# EAGLE design Moteino_Leo (EAGLE 6.3)
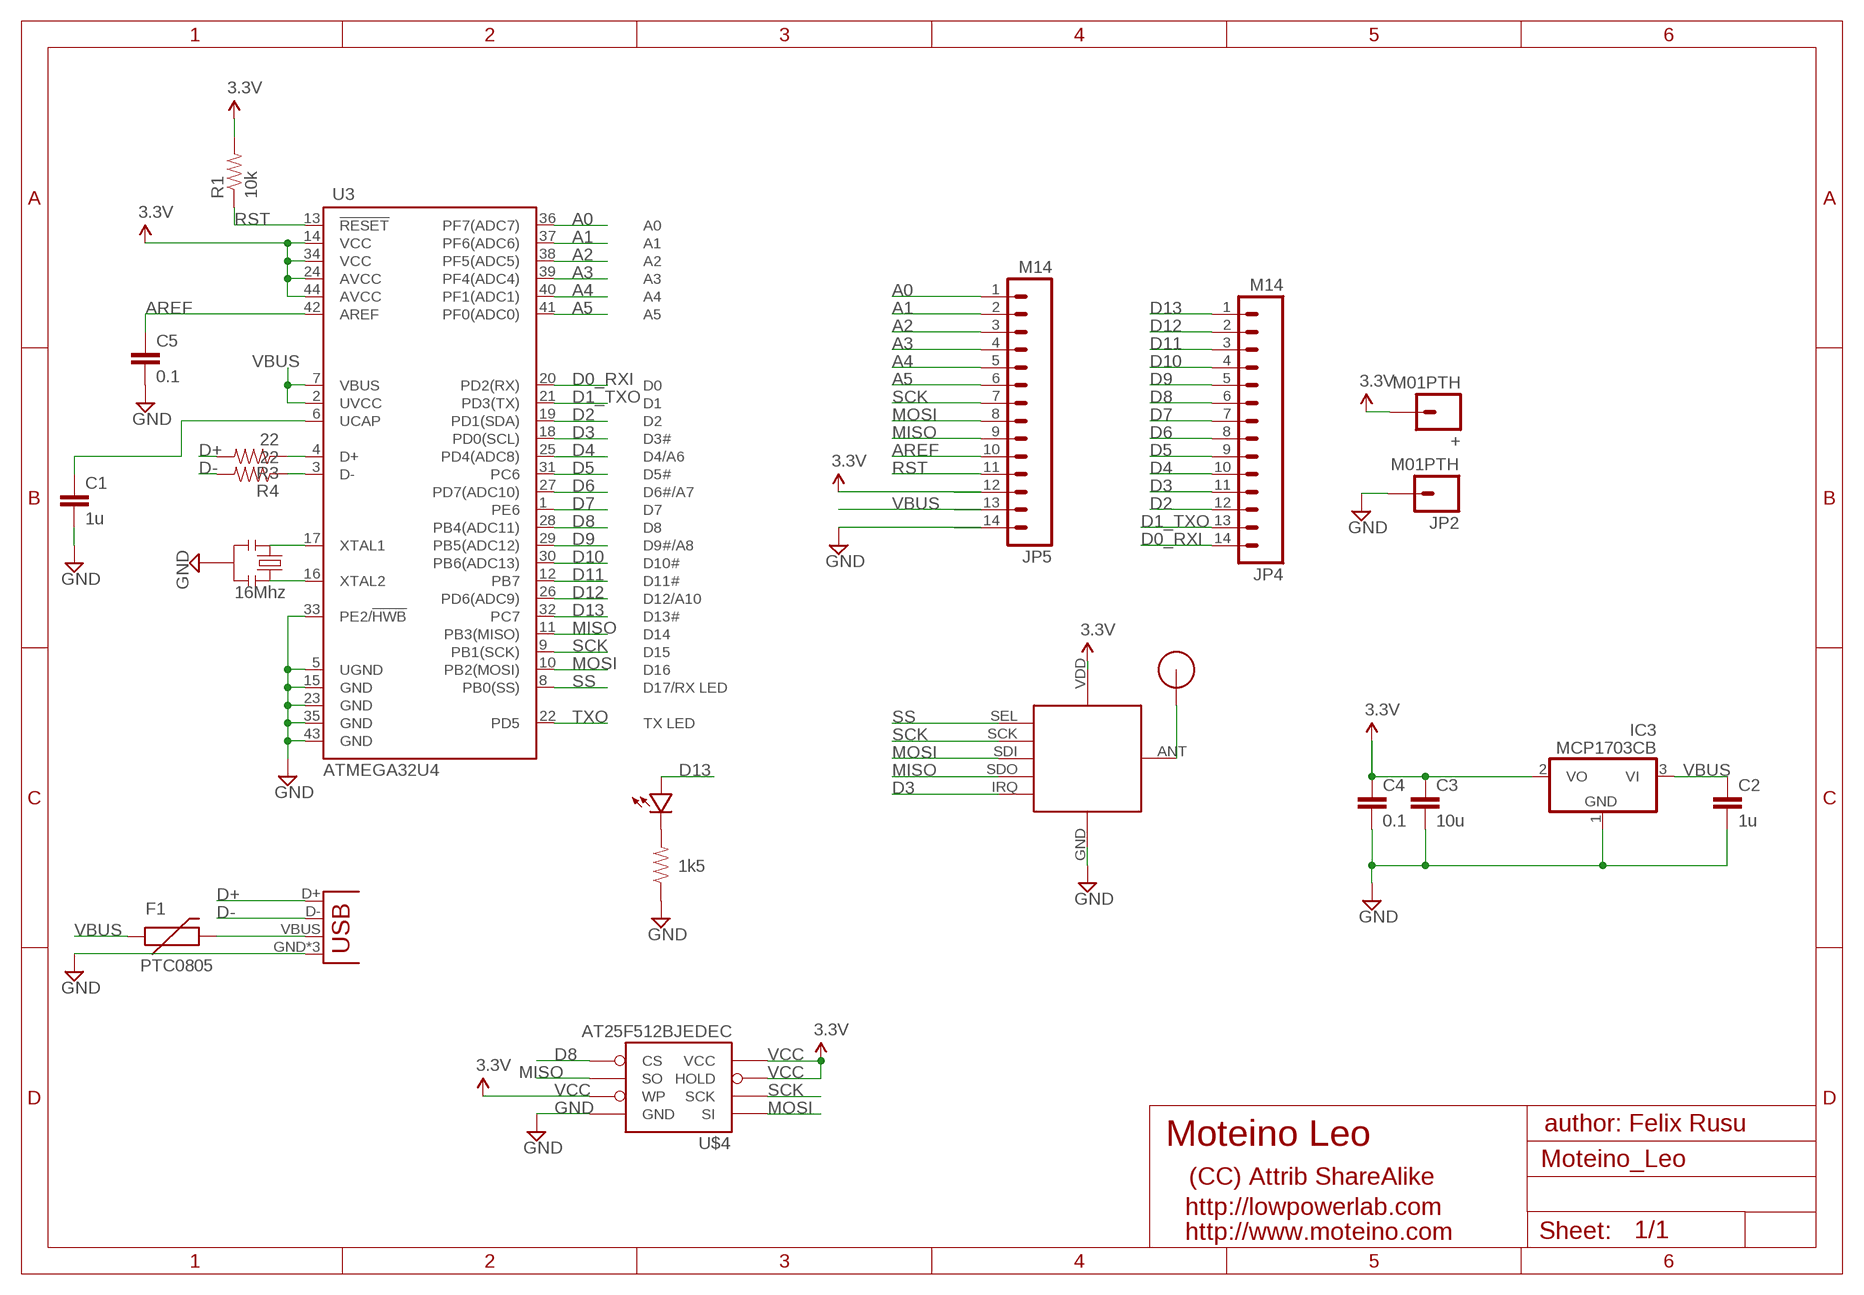
[diagram p0: schematic, sheet 1]

## Parts
+  M01PTH  [1X01]
C1  1u  CAP0603-CAP  [0603-CAP]
C2  1u  CAP0603-CAP  [0603-CAP]
C3  10u  CAP0805-CAP  [0805-CAP]
C4  0.1  CAP0603-CAP  [0603-CAP]
C5  0.1  CAP0603-CAP  [0603-CAP]
F1  PTC0805  [0805-PTC]
IC3  MCP1703CB  [SOT23]
JP2  M01PTH  [1X01]
JP3  USB-MICROB  [USB-MICROB]
JP4  M14  [1X14]
JP5  M14  [1X14]
R1  10k  RESISTOR0603-RES  [0603-RES]
R2  1k5  RESISTOR0603-RES  [0603-RES]
R3  22  RESISTOR0603-RES  [0603-RES]
R4  22  RESISTOR0603-RES  [0603-RES]
RFM12B  RFM12B_MINPADS  [RFM12B-MINPADS]
U3  ATMEGA32U4  ATMEGA32U4QFN2  [QFN-44-NOPAD]
U$1  RFM12B_ANTENNA  [RFM12B-ANTENNA]
U$2  LED0603  [0603-LED]
U$4  AT25F512BJEDEC  [SO08]
X1  16Mhz  RESONATORSMD  [RESONATOR-SMD]

## Nets
A0: JP5.1 U3.36(PF7(ADC7))
A1: JP5.2 U3.37(PF6(ADC6))
A2: JP5.3 U3.38(PF5(ADC5))
A3: JP5.4 U3.39(PF4(ADC4))
A4: JP5.5 U3.40(PF1(ADC1))
A5: JP5.6 U3.41(PF0(ADC0))
AREF: C5.1 JP5.10 U3.42(AREF)
D0_RXI: JP4.14 U3.20(PD2(RX))
D1_TXO: JP4.13 U3.21(PD3(TX))
D2: JP4.12 U3.19(PD1(SDA))
D3: JP4.11 RFM12B.IRQ U3.18(PD0(SCL))
D4: JP4.10 U3.25(PD4(ADC8))
D5: JP4.9 U3.31(PC6)
D6: JP4.8 U3.27(PD7(ADC10))
D7: JP4.7 U3.1(PE6)
D8: JP4.6 U3.28(PB4(ADC11)) U$4.1_CS(CS)
D9: JP4.5 U3.29(PB5(ADC12))
D10: JP4.4 U3.30(PB6(ADC13))
D11: JP4.3 U3.12(PB7)
D12: JP4.2 U3.26(PD6(ADC9))
D13: JP4.1 U3.32(PC7) U$2.PLUS
D+: JP3.D+ R3.2
D-: JP3.D- R4.2
GND [power]: C1.2 C2.2 C3.2 C4.2 C5.2 IC3.1(GND) JP2.1 JP3.GND JP3.MT1(GND) JP3.MT2(GND) JP5.14 R2.1 RFM12B.GND U3.5(UGND) U3.15(GND) U3.23(GND) U3.33(PE2/!HWB) U3.35(GND) U3.43(GND) U$4.4_GND(GND) X1.2
MISO: JP5.9 RFM12B.SDO(SDO/MISO) U3.11(PB3(MISO)) U$4.2_SO(SO)
MOSI: JP5.8 RFM12B.SDI(SDI/MOSI) U3.10(PB2(MOSI)) U$4.5_SI(SI)
N$1: R2.2 U$2.MINUS
N$3: RFM12B.ANT U$1.P$1
N$4: U3.16(XTAL2) X1.3
N$5: U3.17(XTAL1) X1.1
N$6: C1.1 U3.6(UCAP)
N$7: R3.1 U3.4(D+)
N$8: R4.1 U3.3(D-)
RST: JP5.11 R1.1 U3.13(!RESET)
SCK: JP5.7 RFM12B.SCK U3.9(PB1(SCK)) U$4.6_SCK(SCK)
SS: RFM12B.SEL U3.8(PB0(SS))
TXO: U3.22(PD5)
USBPOWER [power]: F1.2 JP3.VBUS
VBUS [power]: C2.1 F1.1 IC3.3(VI) JP5.13 U3.2(UVCC) U3.7(VBUS)
VCC [power]: +.1 C3.1 C4.1 IC3.2(VO) JP5.12 R1.2 RFM12B.VDD U3.14(VCC) U3.24(AVCC) U3.34(VCC) U3.44(AVCC) U$4.3_WP(WP) U$4.7_HOLD(HOLD) U$4.8_VCC(VCC) ; supply symbol labelled 3.3V

## Notes on the sheet
- author: Felix Rusu
- Moteino Leo
- (CC) Attrib ShareAlike
- http://lowpowerlab.com
- http://www.moteino.com

## Library data of the parts
+ JP2 = SparkFun-Connectors:M01: Header 1 Standard 1-pin 0.1" header. Use with straight break away headers (SKU : PRT-00116), right angle break away headers (PRT-00553), swiss pins (PRT-00743), machine pins (PRT-00117), and female headers (PRT-00115).
C1-C5 = LowPowerLab:CAP: Capacitor Standard 0603 ceramic capacitor, and 0.1" leaded capacitor.
F1 = LowPowerLab:PTC: Resettable Fuse PTC Resettable Fuse. Spark Fun Electronics SKU : COM-08357
IC3 = linear:MCP1703: 250 mA, 16V, Low Quiescent Current LDO Regulator Source: http://ww1.microchip.com/downloads/en/DeviceDoc/22049b.pdf
JP3 = SparkFun-Connectors:USB: USB Connectors USB-B-PTH is fully proven SKU : PRT-00139/CONN-08278 USB-miniB is fully proven SKU : PRT-00587 USB-A-PCB is untested. USB-A-H is throughly reviewed, but untested. Spark Fun Electronics SKU : PRT-00437 USB-B-SMT is throughly reviewed, but untested. Needs silkscreen touching up. USB-A-S has not been used/tested USB-MB-H has not been used/tested USB-MICROB has been used. CONN-09505; PROD_ID: CONN-09505
JP4 JP5 = SparkFun-Connectors:M14: Header 14 Standard 14-pin 0.1" header. Use with straight break away headers (SKU : PRT-00116), right angle break away headers (PRT-00553), swiss pins (PRT-00743), machine pins (PRT-00117), and female headers (PRT-00115).
R1-R4 = LowPowerLab:RESISTOR: Resistor Basic schematic elements and footprints for 0603, 1206, and PTH resistors.
RFM12B = LowPowerLab:RFM12B_MINPADS
U3 = SparkFun:ATMEGA32U4
U$1 = LowPowerLab:RFM12B_ANTENNA
U$2 = LowPowerLab:LED
U$4 = LowPowerLab:AT25F512B: 4-Mbit SPI flash memory
X1 = SparkFun:RESONATOR: Resonator Small SMD resonator. This is the itty bitty 10/20MHz resonators with built in caps. CSTCE10M0G55 and CSTCE20M0V53. Footprint has been reviewed closely but hasn't been tested yet.

## Net classes
1 power: width 0.203 mm, clearance 0.152 mm

## Board
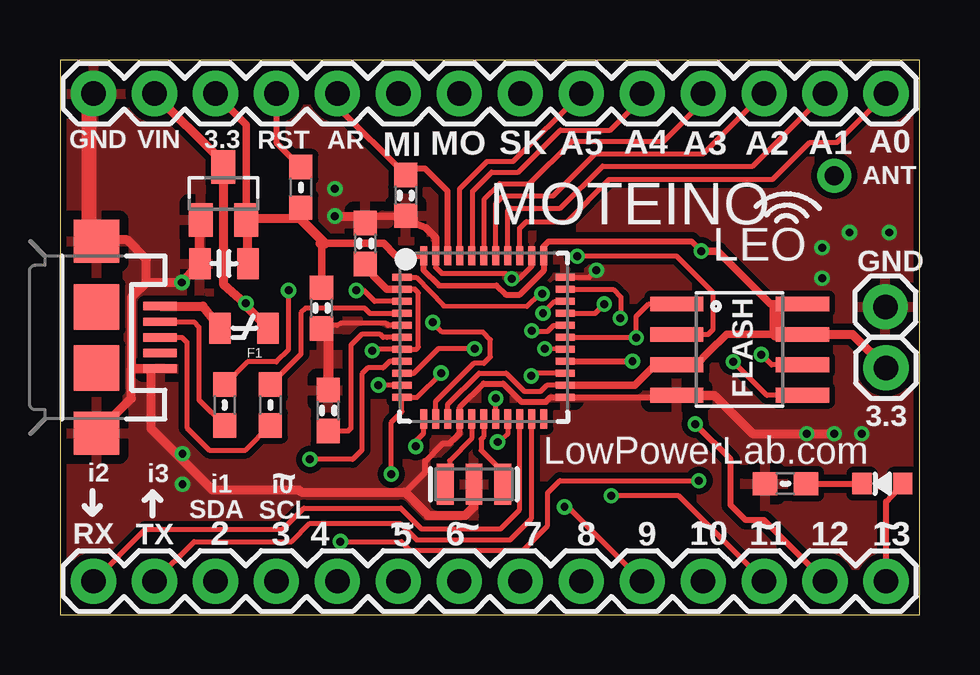
[diagram p1: board, top side]
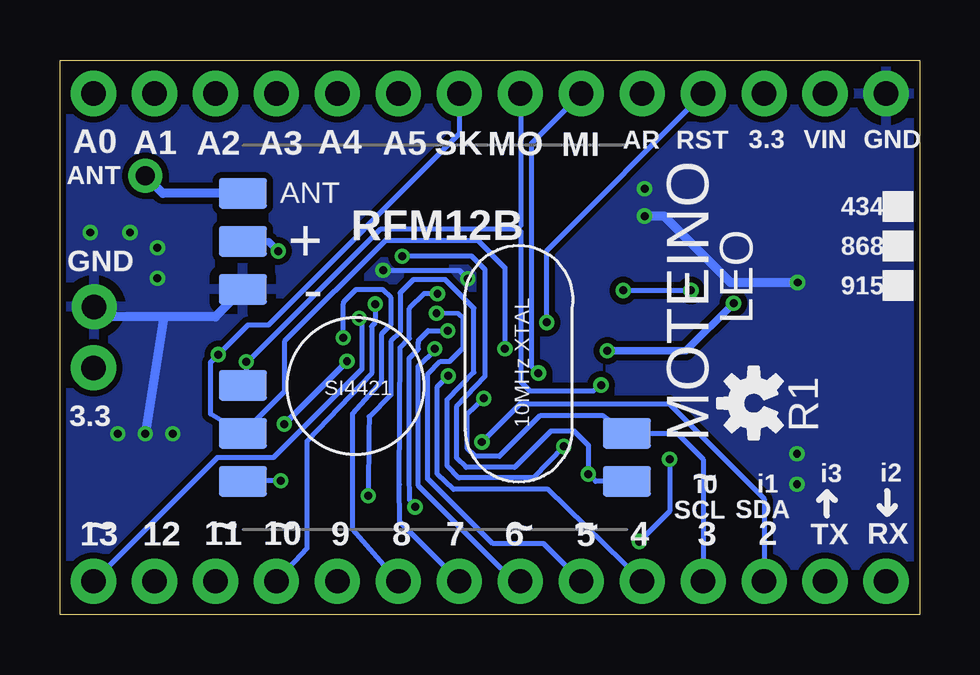
[diagram p2: board, bottom side, seen from below]

Size 35.81 x 23.11 mm. Coordinates in mm from the lower left corner, seen from the top.
Outline: 0,0 35.81,0 35.81,23.11 0,23.11 0,0
Copper layers (1*16): Top 0.035mm / dielectric 1.5mm / Bottom 0.035mm
Design rules "Moteino_leonardo *": minimum track width 6mil, minimum drill 12mil, track to track 10mil, track to pad 10mil, pad to pad 6mil, via to via 6mil, smd to smd 0mil, copper to edge 10mil, drill to drill 10mil, minimum pad ring 10mil, minimum via ring 6mil, stop-mask expansion 2mil, vias tented up to drill 100mil, thermal gap 15mil

### Footprints (pad centres in the part's own frame; a part is rotated, then mirrored left to right if it is on the bottom)
1X01 = drill 1.016 pad 1.88: 1 0,0
0603-CAP = smd 1.016 x 0.965: 1 -0.85,0; 2 0.85,0
0805-CAP = smd 0.902 x 1.3: 1 -1,0; 2 1,0
0805-PTC = smd 0.902 x 1.3: 1 -1,0; 2 1,0
SOT23 = smd 1 x 1.4: 1 -0.95,-1.1; 2 0.95,-1.1; 3 0,1.1
USB-MICROB = smd 0.35 x 1.4: D+ 0,2.65; D- -0.65,2.65; GND 1.3,2.65; ID 0.65,2.65; VBUS -1.3,2.65 | smd 1.8 x 1.9: MT1 -4,0; MT2 4,0 | smd 1.9 x 1.9: P$1 -1.27,0; P$2 1.27,0
1X14 = drill 1.016 pad 1.88: 1 0,0; 2 2.54,0; 3 5.08,0; 4 7.62,0; 5 10.16,0; 6 12.7,0; 7 15.24,0; 8 17.78,0; 9 20.32,0; 10 22.86,0; 11 25.4,0; 12 27.94,0; 13 30.48,0; 14 33.02,0
0603-RES = smd 1.016 x 0.965: 1 -0.85,0; 2 0.85,0
RFM12B-MINPADS = smd 2 x 1.27: ANT 8,-6; GND 8,-2; IRQ -8,4; SCK 8,4; SDI 8,2; SDO -8,6; SEL 8,6; VDD 8,-4
QFN-44-NOPAD = smd 0.8 x 0.3: 1 -3.4,2.5; 2 -3.4,2; 3 -3.4,1.5; 4 -3.4,1; 5 -3.4,0.5; 6 -3.4,0; 7 -3.4,-0.5; 8 -3.4,-1; 9 -3.4,-1.5; 10 -3.4,-2; 11 -3.4,-2.5; 23 3.4,-2.5; 24 3.4,-2; 25 3.4,-1.5; 26 3.4,-1; 27 3.4,-0.5; 28 3.4,0; 29 3.4,0.5; 30 3.4,1; 31 3.4,1.5; 32 3.4,2; 33 3.4,2.5 | smd 0.3 x 0.8: 12 -2.5,-3.4; 13 -2,-3.4; 14 -1.5,-3.4; 15 -1,-3.4; 16 -0.5,-3.4; 17 0,-3.4; 18 0.5,-3.4; 19 1,-3.4; 20 1.5,-3.4; 21 2,-3.4; 22 2.5,-3.4; 34 2.5,3.4; 35 2,3.4; 36 1.5,3.4; 37 1,3.4; 38 0.5,3.4; 39 0,3.4; 40 -0.5,3.4; 41 -1,3.4; 42 -1.5,3.4; 43 -2,3.4; 44 -2.5,3.4
RFM12B-ANTENNA = drill 0.8 pad 1.422: P$1 0,0
0603-LED = smd 0.8 x 0.9: MINUS -0.85,0; PLUS 0.85,0
SO08 = smd 0.61 x 2.21: 1_CS -1.905,-2.616; 2_SO -0.635,-2.616; 3_WP 0.635,-2.616; 4_GND 1.905,-2.616; 5_SI 1.905,2.616; 6_SCK 0.635,2.616; 7_HOLD -0.635,2.616; 8_VCC -1.905,2.616
RESONATOR-SMD = smd 0.7 x 1.7: 1 -1.2,0; 2 0,0; 3 1.2,0

### Placement (x,y rotation side)
+  34.42,10.29 270 top
C1  11.18,8.51 90 top
C2  12.73,15.47 90 top
C3  6.83,14.63 180 top
C4  10.9,12.78 270 top
C5  14.4,17.48 270 top
F1  7.67,11.94 180 top
IC3  6.81,17.55 0 top
JP2  34.39,12.83 0 top
JP3  1.52,11.56 270 top
JP4  34.42,1.4 180 top
JP5  34.42,21.72 180 top
R1  10.03,17.81 270 top
R2  30.23,5.46 0 top
R3  8.76,8.74 270 top
R4  6.86,8.74 270 top
RFM12B  20.19,11.56 180 bottom
U3  17.65,11.56 0 top
U$1  32.26,18.29 0 top
U$2  34.26,5.46 0 top
U$3  [OSHW-LOGO-S]  6.91,8.81 90 bottom
U$4  28.32,11.05 270 top
X1  17.25,5.44 180 top

### Tracks (layer width: path | path; a pad name or v marks a point on that pad's centre or on a via)
A0
  Top 0.203: U3.36 19.15,16.11 19.43,16.38 21.13,16.38 22.89,18.14 29.69,18.14 31.24,19.68 32.38,19.68 JP5.1
A1
  Top 0.203: U3.37 18.65,16.82 18.77,16.94 20.85,16.94 22.61,18.69 28.85,18.69 JP5.2
A2
  Top 0.203: U3.38 18.16,14.96 18.16,17.14 18.47,17.45 20.55,17.45 22.3,19.2 26.8,19.2 29.31,21.72 JP5.3
A3
  Top 0.203: U3.39 17.68,14.98 17.68,17.32 18.31,17.96 19.56,17.96 21.34,19.74 25.15,19.74 26.8,21.39 JP5.4
A4
  Top 0.203: U3.40 17.2,15 17.2,17.65 17.98,18.44 19.1,18.44 20.85,20.19 22.94,20.19 24.26,21.51 JP5.5
A5
  Top 0.203: U3.41 16.65,17.75 17.79,18.89 18.89,18.89 JP5.6
AREF
  Top 0.254: U3.42 16.15,17.65 15.21,18.59 14.54,18.59 C5.1 11.56,21.17 JP5.10
D0_RXI
  Top 0.203: JP4.14 3.56,3.56 9.27,3.56 10.16,4.45 14.2,4.45 15.06,3.58 18.36,3.58 19.15,4.38 U3.20
D1_TXO
  Top 0.203: JP4.13 5.59,3.05 9.65,3.05 10.41,3.81 14.17,3.81 14.86,3.12 18.75,3.12 19.65,4.03 U3.21
D2  (via drill 0.33 pad 0.61)
  Top 0.152: 18.65,7.53 18.64,7.5
  Top 0.203: U3.19 18.65,7.53 | 18.64,7.5 v18.23,7.2
  Bottom 0.203: v18.23,7.2 16.64,8.79 10.44,8.79 6.48,4.83 JP4.12
D3  (via drill 0.33 pad 0.61)
  Top 0.203: U3.18 v18.15,9.01
  Bottom 0.203: v18.15,9.01 18.84,8.38 18.84,6.92 18.52,6.59 17.5,6.59 15.81,8.28 13.17,8.28 RFM12B.IRQ 10.1,7.56 9.02,6.48 JP4.11
D4  (via drill 0.33 pad 0.61)
  Top 0.203: U3.25 19.75,10.06 v19.64,9.95
  Bottom 0.203: JP4.10 15.48,5.22 19.43,5.22 20.09,5.86 20.09,9.5 v19.64,9.95
D5  (via drill 0.33 pad 0.61)
  Top 0.203: v20.12,12.56 20.62,13.06 U3.31
  Bottom 0.203: JP4.9 15.66,2.96 17.78,2.96 20.5,5.66 20.5,10.02 19.96,10.56 19.58,10.56 19.02,11.12 19.02,12.32 19.02,12.36 19.23,12.55 v20.12,12.56
D6  (via drill 0.33 pad 0.61)
  Top 0.203: U3.27 v20.2,11.08
  Bottom 0.152: 20.15,11.06 20.12,11.08 v20.2,11.08
  Bottom 0.203: JP4.8 17.42,1.93 20.88,5.38 20.88,10.37 20.15,11.06
D7  (via drill 0.33 pad 0.61)
  Top 0.203: U3.1 14.84,14.06 15.98,12.87 19.46,12.85 19.98,13.38 v20.09,13.38
  Bottom 0.203: v20.09,13.38 20.64,13.38 21.26,12.76 21.26,11.52 21.64,11.13 21.67,5.43 21.66,3.88 JP4.7
D8  (via drill 0.33 pad 0.61)
  Top 0.203: U3.28 23.85,11.56 v24.01,11.55 24.01,12.43 24.54,12.95 U$4.1_CS
  Bottom 0.203: JP4.6 23.63,3.56 23.62,8.38 22.41,9.72 22.41,11.72 22.02,12.1 22.02,13.2 22.37,13.55 23.49,13.55 24,13.03 24.01,12.96 v24.01,11.55
D9  (via drill 0.33 pad 0.61)
  Top 0.203: v21.02,4.49 21.14,4.52 JP4.5 | v19.65,11.83 19.67,11.81 20.32,11.81 20.57,12.06 U3.29
  Bottom 0.203: v21.02,4.49 21.25,4.79 21.26,5.92 21.26,10.68 20.88,11.06 20.88,11.31 20.87,11.44 20.47,11.84 v19.65,11.83
D10  (via drill 0.33 pad 0.61)
  Top 0.152: 22.29,12.56 22.31,12.56
  Top 0.203: 22.31,12.56 v22.68,12.94 | U3.30 22.29,12.56
  Bottom 0.203: JP4.4 25.53,2.76 25.53,7.24 22.84,10.06 22.84,12.01 22.68,12.17 v22.68,12.94
D11  (via drill 0.33 pad 0.61)
  Top 0.203: JP4.3 25.78,4.96 v22.97,4.96 | U3.12 15.14,7.54 14.82,7.23 v14.82,7.01
  Bottom 0.203: v14.82,7.01 16.1,5.71 19.2,5.71 19.68,6.21 19.68,8.96 18.57,10.1 18.57,12.78 19.75,13.96 21.09,13.96 21.64,13.41 21.64,11.77 22.02,11.39 22.02,9.17 22.94,8.26 22.94,7.59 v22.97,4.96
D12  (via drill 0.33 pad 0.61)
  Top 0.254: U3.26 v23.86,10.56 | JP4.2 29.34,3.94 28.57,3.94 27.94,4.57 27.94,6.47 v26.47,7.95
  Bottom 0.254: v26.47,7.95 v23.86,10.56
D13  (via drill 0.33 pad 0.61)
  Top 0.203: U3.32 23.04,13.56 23.37,13.23 23.37,12.41 v23.34,12.36
  Top 0.254: JP4.1 34.42,4.71 U$2.PLUS
  Bottom 0.203: v23.34,12.36 23.24,12.25 23.24,10.23 26.93,6.55 29.27,6.55 JP4.1
D+
  Top 0.203: JP3.D+ 5.08,11.56 5.28,11.35 5.28,7.8 6.22,6.86 7.73,6.86 R3.2
D-
  Top 0.203: JP3.D- 5.57,12.21 5.79,11.99 5.79,8.95 R4.2
GND  (via drill 0.33 pad 0.61)
  Top 0.203: U3.5 13.67,12.06 13.59,12.14 11.68,12.14 11.55,12.06 11.03,12.06 C4.2 | 1.21,15.87 JP3.MT1 | U3.33 22.06,14.06 v22.35,14.35 | 25.62,9.06 U$4.4_GND | C5.2 14.41,16.32 14.73,16.61 | U3.43 15.65,14.47 15.9,14.22 18.59,14.22 v18.82,13.99 19.13,14 19.66,14.53 U3.35
  Top 0.254: 14.38,5.11 15.21,5.94 15.21,6.4 15.95,7.14 16.23,7.14 16.65,7.56 U3.15 16.66,8.64 17.65,9.63 18.47,9.63 19.23,8.87 20.24,8.87 20.44,9.06 U3.23 25.62,9.06
  Top 0.305: U3.43 15.65,15.72 15.24,16.13 14.78,16.31 14.73,16.61 12.87,16.61 v11.46,16.61
  Top 0.381: U$4.4_GND | U$4.4_GND | U$4.4_GND | U$4.4_GND | U$4.4_GND 25.71,9.14 25.72,9.14 25.74,9.14 25.78,9.14 25.85,9.14 26,9.14 26.89,9.14 | v32.26,7.54 28.86,7.54 27.25,9.14 26.89,9.14 | 26.89,9.14 | X1.2 17.25,4.5 16.89,4.14 16.82,4.14 15.34,4.14 14.38,5.11 10.06,5.11 9.95,5.21 6.35,5.21 3.79,7.77 3.79,10.26 | 2.98,10.26 2.98,13.22 3.6,13.84 | JP3.GND 3.79,10.26 | 2.98,10.26 3.6,10.26 3.79,10.26 | JP3.MT2 2.98,9.01 2.98,10.26 | 3.6,13.84 v5.08,13.84 5.41,14.18 C3.2 5.83,16.3 IC3.1 | 3.6,13.84 3.6,14.81 2.79,15.62 1.59,15.62 JP3.MT1 1.21,15.87 | v11.46,16.61 12.87,16.61 C2.2
  Top 0.406: C4.2 11.18,11.93 C1.2
  Top 0.635: JP5.14 1.21,21.53 1.21,15.87
  Bottom 0.203: v22.35,14.35 19.18,14.35 v18.82,13.99
  Bottom 0.381: 31.5,12.41 v32.26,7.54 | v5.08,13.84 7.87,13.84 10.64,16.61 v11.46,16.61 | RFM12B.GND 29.34,12.41 31.5,12.41 | 31.5,12.41 33.98,12.41 JP2.1
  other vias: 33.41,7.54 34.55,15.93 31.75,15.29 31.12,7.54 32.9,15.93 31.75,14.02 11.46,17.75 5.11,5.44 5.11,6.71
  pour Top: 0,23.11 35.81,23.11 35.81,0 0,0
  pour Bottom: 0,23.11 35.81,23.11 35.81,0 0,0
MISO  (via drill 0.33 pad 0.61)
  Top 0.203: v21.56,14.94 25.7,14.94 27.22,13.42 27.22,11.89 27.03,11.71 27,11.68 U$4.2_SO | v15.88,10.07 14.87,9.06 U3.11 14.25,8.46 13.8,8.01 v13.8,5.86
  Bottom 0.203: v15.88,10.07 16.17,10.36 16.17,19.65 JP5.9 | v21.56,14.94 18.66,14.94 18.1,14.38 18.1,9.94 19.27,8.69 19.27,6.51 18.89,6.14 16.87,6.14 15.36,7.65 14.39,7.65 13.8,7.06 v13.8,5.86 13.5,5.56 RFM12B.SDO
MOSI  (via drill 0.33 pad 0.61)
  Top 0.203: U3.10 13.41,9.56 v13.27,9.57 | U$4.5_SI 29.45,9.14 v28.05,10.55
  Bottom 0.152: 27.58,9.56 RFM12B.SDI
  Bottom 0.203: 16.7,16.08 16.61,15.96 16.61,9.7 16.23,9.32 13.59,9.32 v13.27,9.57 | 16.7,16.08 22.45,16.08 27.8,10.72 v28.05,10.55 28.05,9.7 RFM12B.SDI 28.07,9.89 | JP5.8 16.61,21.41 16.61,16.23 16.7,16.08
N$1
  Top 0.254: R2.2 U$2.MINUS
N$3
  Bottom 0.381: RFM12B.ANT 31.53,17.56 U$1.P$1
N$4
  Top 0.203: U3.16 17.15,7.35 16.23,6.43 16.23,5.62 X1.3
N$5
  Top 0.203: U3.17 17.65,7.42 17.55,7.32 17.55,6.84 18.21,6.18 18.32,6.01 X1.1
N$6
  Top 0.203: C1.1 12.01,7.66 12.12,7.76 12.12,11.24 12.56,11.68 13.34,11.68 13.46,11.56 13.62,11.56 U3.6
N$7
  Top 0.203: U3.4 12.91,12.56 12.69,12.77 10.23,12.77 10.03,12.57 10.03,10.86 R3.1
N$8  (via drill 0.33)
  Top 0.203: U3.3 13.11,13.06 12.65,13.51 v12.34,13.51 | R4.1 7.81,10.54 9.02,10.54 9.53,11.05 v9.53,13.51
  Bottom 0.203: v12.34,13.51 v9.53,13.51
RST  (via drill 0.33 pad 0.61)
  Top 0.203: U3.13 15.65,8.89 17.24,10.47 17.66,10.47 17.94,10.75 17.94,11.46 17.63,11.77 15.94,11.77 v15.53,12.18
  Top 0.254: JP5.11 9.02,19.67 R1.1
  Bottom 0.203: v15.53,12.18 15.53,15.18 JP5.11
SCK  (via drill 0.33 pad 0.61)
  Top 0.203: U3.9 14.73,10.06 15.77,11.1 17.28,11.1 v17.28,11.08 | v29.22,10.84 29.25,10.81 29.65,10.41 U$4.6_SCK
  Bottom 0.203: v17.28,11.08 17.28,14.47 18.42,15.61 22.25,15.61 26.45,11.41 26.45,9.3 RFM12B.SCK 29.55,8.37 29.55,10.51 v29.22,10.84 27.99,12.06 27.13,12.06 19.18,20.05 JP5.7
SS  (via drill 0.33)
  Top 0.203: U3.8 13.73,10.56 13.46,10.29 12.83,10.29 12.57,10.03 12.57,6.86 12.19,6.48 v10.41,6.48 | v11.68,3.05 14.22,3.05 14.58,2.69 19.3,2.69 20.32,3.71 20.32,5.08 20.83,5.59 v26.62,5.59
  Bottom 0.203: v10.41,6.48 10.41,4.32 v11.68,3.05 | v26.62,5.59 28.16,5.59 RFM12B.SEL
USBPOWER
  Top 0.381: JP3.VBUS 5.96,12.86 F1.2
VBUS  (via drill 0.33 pad 0.61)
  Top 0.203: U3.7 13.07,11.06 v13.01,11 | 14.49,11.06 14.84,11.06 14.94,11.15 14.94,13.41 14.78,13.56 U3.2
  Top 0.254: v7.75,12.98 7.75,13 7.7,12.98
  Top 0.305: 14.49,11.06 U3.7 | U3.2 13.62,13.56 13.18,13.99 12.87,14.33 C2.1 12.74,14.48
  Top 0.381: JP5.13 6.65,19.01 IC3.3 6.83,18.78 6.83,14.22 6.83,13.74 7.7,12.98 | F1.1 7.73,12.9 v7.75,12.98
  Bottom 0.305: v13.01,11 9.73,11 v7.75,12.98
VCC  (via drill 0.33 pad 0.61)
  Top 0.203: U3.14 16.15,8.76 17.46,10.07 18.59,10.07 19.34,9.32 20.03,9.32 20.27,9.56 U3.24 | 20.14,15.34 U3.34 20.15,14.66 | 30.05,12.95 29.81,12.78 | U$4.3_WP 24.8,10.41 | U$4.7_HOLD 29.81,11.68 | 27.81,11.68 27.79,11.68 | 10.9,15.33 10.86,15.47
  Top 0.254: v26.72,15.15 26.32,15.56 20.59,15.56 20.36,15.56 20.14,15.34 | 20.15,14.66 20.15,14.33 19.16,13.34 18.57,13.34 18.19,13.72 15.79,13.72 15.14,14.36 15.14,14.87
  Top 0.305: 24.8,10.41 23.95,9.56 U3.24 | v26.72,15.15 27.4,15.15 29.6,12.95 30.05,12.95 | 30.05,12.95 U$4.8_VCC 30.05,12.95 | 27.81,11.68 29.81,11.68 U$4.7_HOLD | 27.79,11.68 27.04,10.95 26.5,10.41 U$4.3_WP | 15.14,14.87 U3.44 15.12,14.99 14.61,14.99 13.97,14.99 13.49,15.47 11.04,15.47 10.86,15.47 | IC3.2 7.76,20.41 JP5.12 | C4.1 10.9,15.33
  Top 0.381: R1.2 10,16.51 7.86,16.51 7.99,16.81 IC3.2 7.83,16.25 C3.1 | U$4.7_HOLD 33.02,11.68 +.1
  Top 0.406: 10.86,15.47 11.04,15.47 10,16.51
  Top 0.508: 29.81,12.78 29.81,11.68
  Bottom 0.203: RFM12B.VDD 27.37,15.56
  Bottom 0.305: v26.72,15.15 27.12,15.55 27.37,15.56

### Text on the board
bPlace: RFM12B
Document: FLASH
tDocu: REG | 32u4
_tsilk: VIN | 3.3 | MI | MO | SK | A5 | A4 | A3 | A2 | A1 | GND | RST | AR | A0 | ANT | MOTEINO | LEO | GND | FLASH | 3.3 | i2 | i3 | i1 | i0 | ~ | LowPowerLab.com | SDA | RX | TX | 2 | SCL | 3 | 4 | 5 | ~ | 6 | ~ | 7 | 8 | 9 | ~ | 10 | ~ | 11 | 12 | ~ | 13
_bsilk: VIN | 3.3 | MI | MO | SK | A5 | A4 | A3 | A2 | A1 | A0 | GND | RST | AR | ANT | 434 | 868 | 915 | GND | LEO | R1 | 3.3 | MOTEINO | i2 | i3 | i1 | i0 | ~ | SDA | RX | TX | 2 | 3 | SCL | 4 | ~ | 5 | ~ | 6 | 7 | 8 | 9 | 10 | ~ | 11 | ~ | 12 | 13 | ~